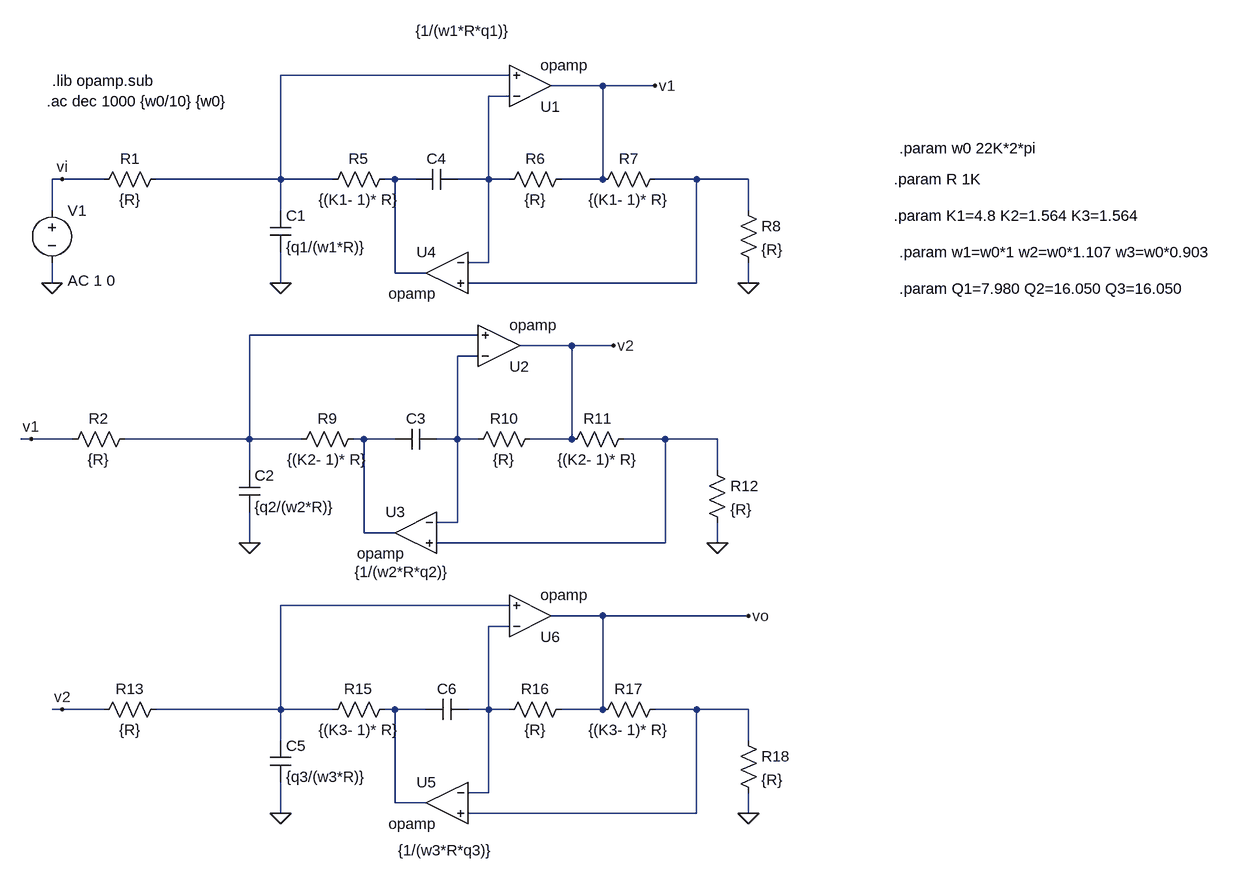
[diagram p0: schematic active-super.asc]
active-super.asc, the LTspice schematic file:
Version 4
SHEET 1 2312 1128
WIRE 672 -80 320 -80
WIRE 816 -64 736 -64
WIRE 896 -64 816 -64
WIRE 672 -48 640 -48
WIRE -16 80 -32 80
WIRE 48 80 -16 80
WIRE 320 80 320 -80
WIRE 320 80 128 80
WIRE 400 80 320 80
WIRE 496 80 480 80
WIRE 528 80 496 80
WIRE 640 80 640 -48
WIRE 640 80 592 80
WIRE 672 80 640 80
WIRE 816 80 816 -64
WIRE 816 80 752 80
WIRE 960 80 896 80
WIRE 1040 80 960 80
WIRE -32 128 -32 80
WIRE 320 128 320 80
WIRE 1040 128 1040 80
WIRE 640 208 640 80
WIRE 640 208 608 208
WIRE 496 224 496 80
WIRE 544 224 496 224
WIRE -32 240 -32 208
WIRE 320 240 320 192
WIRE 960 240 960 80
WIRE 960 240 608 240
WIRE 1040 240 1040 208
WIRE 624 320 272 320
WIRE 768 336 688 336
WIRE 832 336 768 336
WIRE 624 352 592 352
WIRE -64 480 -80 480
WIRE 0 480 -64 480
WIRE 272 480 272 320
WIRE 272 480 80 480
WIRE 352 480 272 480
WIRE 448 480 432 480
WIRE 496 480 448 480
WIRE 592 480 592 352
WIRE 592 480 560 480
WIRE 624 480 592 480
WIRE 768 480 768 336
WIRE 768 480 704 480
WIRE 912 480 848 480
WIRE 992 480 912 480
WIRE 272 528 272 480
WIRE 992 528 992 480
WIRE 592 608 592 480
WIRE 592 608 560 608
WIRE 448 624 448 480
WIRE 496 624 448 624
WIRE 272 640 272 592
WIRE 912 640 912 480
WIRE 912 640 560 640
WIRE 992 640 992 608
WIRE 672 736 320 736
WIRE 816 752 736 752
WIRE 1040 752 816 752
WIRE 672 768 640 768
WIRE -16 896 -32 896
WIRE 48 896 -16 896
WIRE 320 896 320 736
WIRE 320 896 128 896
WIRE 400 896 320 896
WIRE 496 896 480 896
WIRE 544 896 496 896
WIRE 640 896 640 768
WIRE 640 896 608 896
WIRE 672 896 640 896
WIRE 816 896 816 752
WIRE 816 896 752 896
WIRE 960 896 896 896
WIRE 1040 896 960 896
WIRE 320 944 320 896
WIRE 1040 944 1040 896
WIRE 640 1024 640 896
WIRE 640 1024 608 1024
WIRE 496 1040 496 896
WIRE 544 1040 496 1040
WIRE 320 1056 320 1008
WIRE 960 1056 960 896
WIRE 960 1056 608 1056
WIRE 1040 1056 1040 1024
FLAG -16 80 vi
FLAG 1040 240 0
FLAG -32 240 0
FLAG 896 -64 v1
FLAG -64 480 v1
FLAG 992 640 0
FLAG 832 336 v2
FLAG -16 896 v2
FLAG 1040 1056 0
FLAG 1040 752 vo
FLAG 320 240 0
FLAG 320 1056 0
FLAG 272 640 0
SYMBOL res 144 64 R90
WINDOW 0 0 56 VBottom 2
WINDOW 3 32 56 VTop 2
SYMATTR InstName R1
SYMATTR Value {R}
SYMBOL cap 304 128 R0
SYMATTR InstName C1
SYMATTR Value {q1/(w1*R)}
SYMBOL res 496 64 R90
WINDOW 0 0 56 VBottom 2
WINDOW 3 32 56 VTop 2
SYMATTR InstName R5
SYMATTR Value {(K1- 1)* R}
SYMBOL cap 592 64 R90
WINDOW 0 0 32 VBottom 2
WINDOW 3 -228 -9 VTop 2
SYMATTR InstName C4
SYMATTR Value {1/(w1*R*q1)}
SYMBOL res 768 64 R90
WINDOW 0 0 56 VBottom 2
WINDOW 3 32 56 VTop 2
SYMATTR InstName R6
SYMATTR Value {R}
SYMBOL res 912 64 R90
WINDOW 0 0 56 VBottom 2
WINDOW 3 32 56 VTop 2
SYMATTR InstName R7
SYMATTR Value {(K1- 1)* R}
SYMBOL OpAmps\\opamp 704 0 M180
SYMATTR InstName U1
SYMATTR SpiceLine2 GBW=10000Meg
SYMBOL OpAmps\\opamp 576 160 M0
SYMATTR InstName U4
SYMATTR SpiceLine2 GBW=10000Meg
SYMBOL res 1024 112 R0
SYMATTR InstName R8
SYMATTR Value {R}
SYMBOL voltage -32 112 R0
WINDOW 123 24 124 Left 2
WINDOW 39 0 0 Left 0
SYMATTR Value2 AC 1 0
SYMATTR InstName V1
SYMATTR Value ""
SYMBOL res 96 464 R90
WINDOW 0 0 56 VBottom 2
WINDOW 3 32 56 VTop 2
SYMATTR InstName R2
SYMATTR Value {R}
SYMBOL cap 256 528 R0
SYMATTR InstName C2
SYMATTR Value {q2/(w2*R)}
SYMBOL res 448 464 R90
WINDOW 0 0 56 VBottom 2
WINDOW 3 32 56 VTop 2
SYMATTR InstName R9
SYMATTR Value {(K2- 1)* R}
SYMBOL cap 560 464 R90
WINDOW 0 0 32 VBottom 2
WINDOW 3 205 53 VTop 2
SYMATTR InstName C3
SYMATTR Value {1/(w2*R*q2)}
SYMBOL res 720 464 R90
WINDOW 0 0 56 VBottom 2
WINDOW 3 32 56 VTop 2
SYMATTR InstName R10
SYMATTR Value {R}
SYMBOL res 864 464 R90
WINDOW 0 0 56 VBottom 2
WINDOW 3 32 56 VTop 2
SYMATTR InstName R11
SYMATTR Value {(K2- 1)* R}
SYMBOL OpAmps\\opamp 656 400 M180
SYMATTR InstName U2
SYMATTR SpiceLine2 GBW=10000Meg
SYMBOL OpAmps\\opamp 528 560 M0
SYMATTR InstName U3
SYMATTR SpiceLine2 GBW=10000Meg
SYMBOL res 976 512 R0
SYMATTR InstName R12
SYMATTR Value {R}
SYMBOL res 144 880 R90
WINDOW 0 0 56 VBottom 2
WINDOW 3 32 56 VTop 2
SYMATTR InstName R13
SYMATTR Value {R}
SYMBOL cap 304 944 R0
SYMATTR InstName C5
SYMATTR Value {q3/(w3*R)}
SYMBOL res 496 880 R90
WINDOW 0 0 56 VBottom 2
WINDOW 3 32 56 VTop 2
SYMATTR InstName R15
SYMATTR Value {(K3- 1)* R}
SYMBOL cap 608 880 R90
WINDOW 0 0 32 VBottom 2
WINDOW 3 217 34 VTop 2
SYMATTR InstName C6
SYMATTR Value {1/(w3*R*q3)}
SYMBOL res 768 880 R90
WINDOW 0 0 56 VBottom 2
WINDOW 3 32 56 VTop 2
SYMATTR InstName R16
SYMATTR Value {R}
SYMBOL res 912 880 R90
WINDOW 0 0 56 VBottom 2
WINDOW 3 32 56 VTop 2
SYMATTR InstName R17
SYMATTR Value {(K3- 1)* R}
SYMBOL OpAmps\\opamp 576 976 M0
SYMATTR InstName U5
SYMATTR SpiceLine2 GBW=10000Meg
SYMBOL res 1024 928 R0
SYMATTR InstName R18
SYMATTR Value {R}
SYMBOL OpAmps\\opamp 704 816 M180
SYMATTR InstName U6
SYMATTR SpiceLine2 GBW=10000Meg
TEXT -40 -40 Left 2 !.ac dec 1000 {w0/10} {w0}
TEXT -32 -72 Left 2 !.lib opamp.sub
TEXT 1264 80 Left 2 !.param R 1K
TEXT 1264 136 Left 2 !.param K1=4.8 K2=1.564 K3=1.564
TEXT 1272 192 Left 2 !.param w1=w0*1 w2=w0*1.107 w3=w0*0.903
TEXT 1272 32 Left 2 !.param w0 22K*2*pi
TEXT 1272 248 Left 2 !.param Q1=7.980 Q2=16.050 Q3=16.050

The netlist it stands for:
* active-super.asc
R1 N001 vi {R}
C1 N001 0 {q1/(w1*R)}
R5 N003 N001 {(K1- 1)* R}
C4 N002 N003 {1/(w1*R*q1)}
R6 v1 N002 {R}
R7 N004 v1 {(K1- 1)* R}
XU1 N002 N001 v1 opamp Aol=100K GBW=10000Meg  ; pins invin noninvin out
XU4 N002 N004 N003 opamp Aol=100K GBW=10000Meg  ; pins invin noninvin out
R8 N004 0 {R}
V1 vi 0 AC 1 0
R2 N005 v1 {R}
C2 N005 0 {q2/(w2*R)}
R9 N007 N005 {(K2- 1)* R}
C3 N006 N007 {1/(w2*R*q2)}
R10 v2 N006 {R}
R11 N008 v2 {(K2- 1)* R}
XU2 N006 N005 v2 opamp Aol=100K GBW=10000Meg  ; pins invin noninvin out
XU3 N006 N008 N007 opamp Aol=100K GBW=10000Meg  ; pins invin noninvin out
R12 N008 0 {R}
R13 N009 v2 {R}
C5 N009 0 {q3/(w3*R)}
R15 N011 N009 {(K3- 1)* R}
C6 N010 N011 {1/(w3*R*q3)}
R16 vo N010 {R}
R17 N012 vo {(K3- 1)* R}
XU5 N010 N012 N011 opamp Aol=100K GBW=10000Meg  ; pins invin noninvin out
R18 N012 0 {R}
XU6 N010 N009 vo opamp Aol=100K GBW=10000Meg  ; pins invin noninvin out
.ac dec 1000 {w0/10} {w0}
.lib opamp.sub
.param R 1K
.param K1=4.8 K2=1.564 K3=1.564
.param w1=w0*1 w2=w0*1.107 w3=w0*0.903
.param w0 22K*2*pi
.param Q1=7.980 Q2=16.050 Q3=16.050
.backanno
.end

* Results of the author's LTspice run, read from the files saved beside the schematic
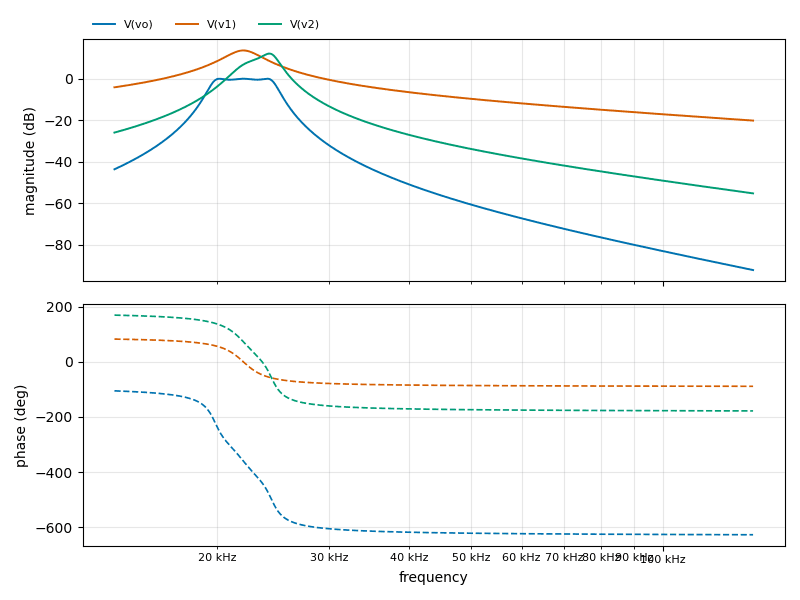
[diagram p1: AC Analysis of active-super.asc, plotted from the saved traces]
* AC Analysis, 1 run:
*   V(vo): -43.60 dB at 13.82 kHz, -92.08 dB at 138.2 kHz, peak -0.01 dB at 23.97 kHz, 3 dB below the peak at 19.58 kHz and 24.71 kHz
*   V(v1): -4.16 dB at 13.82 kHz, -20.16 dB at 138.2 kHz, peak 13.60 dB at 22.01 kHz, 3 dB below the peak at 20.66 kHz and 23.43 kHz
*   V(v2): -25.94 dB at 13.82 kHz, -55.19 dB at 138.2 kHz, peak 12.08 dB at 24.19 kHz, 3 dB below the peak at 22.89 kHz and 24.86 kHz